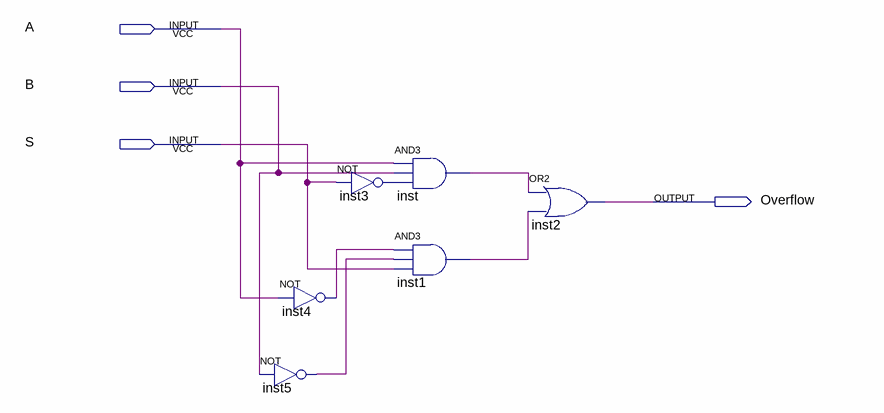
[diagram p0: schematic sheet]
// Quartus schematic Overflow.bdf as structural Verilog: 6 symbols, 4 pins
module Overflow (
  input  A,
  input  B,
  input  S,
  output Overflow
);

  wire inst1_out, inst3_out, inst4_out, inst5_out, inst_out;

  not inst5 (inst5_out, B);
  not inst3 (inst3_out, S);
  not inst4 (inst4_out, A);
  and inst (inst_out, A, B, inst3_out);
  and inst1 (inst1_out, inst4_out, inst5_out, S);
  or inst2 (Overflow, inst_out, inst1_out);
endmodule
